# EAGLE design DarlekDistro (EAGLE 6.5.0)
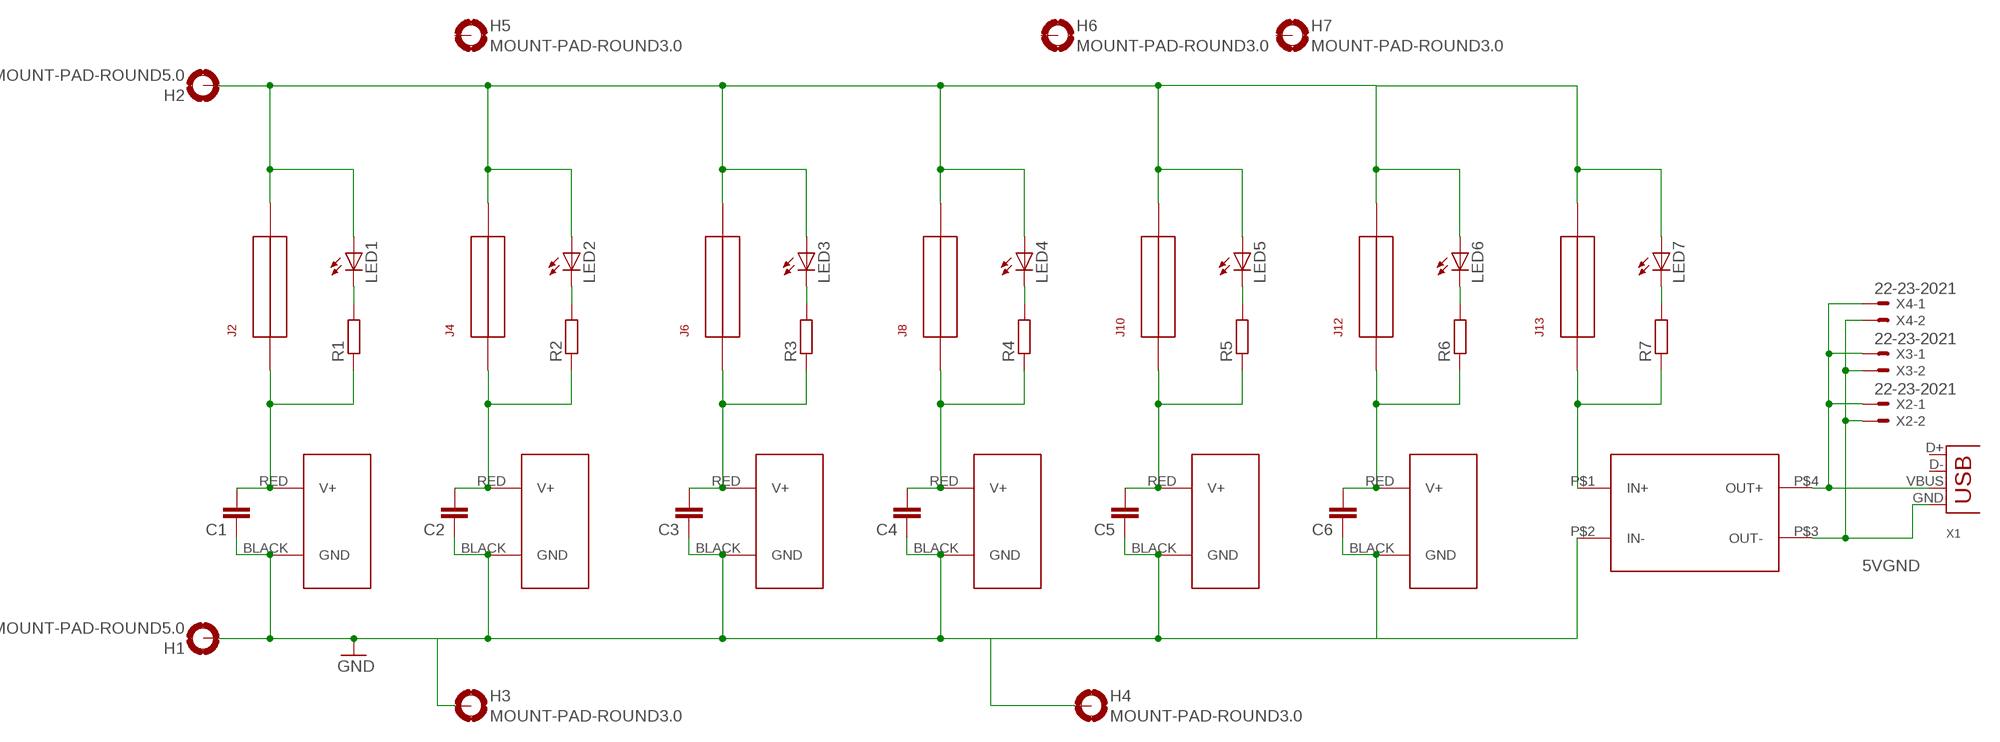
[diagram p0: schematic, sheet 1]

## Parts
C1  C-EU050-025X075  [C050-025X075]
C2  C-EU050-025X075  [C050-025X075]
C3  C-EU050-025X075  [C050-025X075]
C4  C-EU050-025X075  [C050-025X075]
C5  C-EU050-025X075  [C050-025X075]
C6  C-EU050-025X075  [C050-025X075]
H1  MOUNT-PAD-ROUND5.0  [5,0-PAD]
H2  MOUNT-PAD-ROUND5.0  [5,0-PAD]
H3  MOUNT-PAD-ROUND3.0  [3,0-PAD]
H4  MOUNT-PAD-ROUND3.0  [3,0-PAD]
H5  MOUNT-PAD-ROUND3.0  [3,0-PAD]
H6  MOUNT-PAD-ROUND3.0  [3,0-PAD]
H7  MOUNT-PAD-ROUND3.0  [3,0-PAD]
J1  POWERPOLE_POWER10AWG  [POWERPOLE_PAIR_10AWG]
J2  FUSEATC  [FUSE_ATC]
J3  POWERPOLE_POWER10AWG  [POWERPOLE_PAIR_10AWG]
J4  FUSEATC  [FUSE_ATC]
J5  POWERPOLE_POWER10AWG  [POWERPOLE_PAIR_10AWG]
J6  FUSEATC  [FUSE_ATC]
J7  POWERPOLE_POWER10AWG  [POWERPOLE_PAIR_10AWG]
J8  FUSEATC  [FUSE_ATC]
J9  POWERPOLE_POWER10AWG  [POWERPOLE_PAIR_10AWG]
J10  FUSEATC  [FUSE_ATC]
J11  POWERPOLE_POWER10AWG  [POWERPOLE_PAIR_10AWG]
J12  FUSEATC  [FUSE_ATC]
J13  FUSEATC  [FUSE_ATC]
LED1  LED3MM  [LED3MM]
LED2  LED3MM  [LED3MM]
LED3  LED3MM  [LED3MM]
LED4  LED3MM  [LED3MM]
LED5  LED3MM  [LED3MM]
LED6  LED3MM  [LED3MM]
LED7  LED3MM  [LED3MM]
R1  R-EU_0204/7  [0204/7]
R2  R-EU_0204/7  [0204/7]
R3  R-EU_0204/7  [0204/7]
R4  R-EU_0204/7  [0204/7]
R5  R-EU_0204/7  [0204/7]
R6  R-EU_0204/7  [0204/7]
R7  R-EU_0204/7  [0204/7]
U$1  DSN2596_REG  [DSN2596_REG]
X1  USB-A-H  [USB-A-H]
X2  22-23-2021  [22-23-2021]
X3  22-23-2021  [22-23-2021]
X4  22-23-2021  [22-23-2021]

## Nets
5VGND: U$1.P$3(OUT-) X1.GND X2.2 X3.2 X4.2
GND: C1.1 C2.1 C3.1 C4.1 C5.1 C6.1 H1.B5(MOUNT) H3.B3,0(MOUNT) H4.B3,0(MOUNT) J1.BLACK(GND) J3.BLACK(GND) J5.BLACK(GND) J7.BLACK(GND) J9.BLACK(GND) J11.BLACK(GND) U$1.P$2(IN-)
N$1: LED2.K(C) R2.2
N$2: LED1.K(C) R1.2
N$3: LED3.K(C) R3.2
N$4: LED4.K(C) R4.2
N$5: LED5.K(C) R5.2
N$6: LED6.K(C) R6.2
N$7: LED7.K(C) R7.2
N$8: U$1.P$4(OUT+) X1.VBUS X2.1 X3.1 X4.1
PPV1: C1.2 J1.RED(V+) J2.P$1 J2.P$2 R1.1
PPV2: C2.2 J3.RED(V+) J4.P$1 J4.P$2 R2.1
PPV3: C3.2 J5.RED(V+) J6.P$1 J6.P$2 R3.1
PPV4: C4.2 J7.RED(V+) J8.P$1 J8.P$2 R4.1
PPV5: C5.2 J9.RED(V+) J10.P$1 J10.P$2 R5.1
PPV6: C6.2 J11.RED(V+) J12.P$1 J12.P$2 R6.1
PPV7: J13.P$1 J13.P$2 R7.1 U$1.P$1(IN+)
VCC: H2.B5(MOUNT) J2.P$3 J2.P$4 J4.P$3 J4.P$4 J6.P$3 J6.P$4 J8.P$3 J8.P$4 J10.P$3 J10.P$4 J12.P$3 J12.P$4 J13.P$3 J13.P$4 LED1.A LED2.A LED3.A LED4.A LED5.A LED6.A LED7.A
Unconnected: H5.B3,0(MOUNT) H6.B3,0(MOUNT) H7.B3,0(MOUNT) X1.D+ X1.D-

## Library data of the parts
C1-C6 = resistor:C-EU: CAPACITOR, European symbol
H1-H7 = holes:MOUNT-PAD-ROUND: MOUNTING PAD, round
J1 J3 J5 J7 J9 J11 = powerpoles:POWERPOLE_POWER: Anderson Powerpole Power Connector using ameteur radio standard layout
J2 J4 J6 J8 J10 J12 J13 = powerpoles:FUSE
LED1-LED7 = adafruit:LED: LED OSRAM: - CHIPLED LG R971, LG N971, LY N971, LG Q971, LY Q971, LO R971, LY R971 LH N974, LH R974 LS Q976, LO Q976, LY Q976 LO Q996 - Hyper CHIPLED LW Q18S LB Q993, LB Q99A, LB R99A - SideLED LS A670, LO A670, LY A670, LG A670, LP A670 LB A673, LV A673, LT A673, LW A673 LH A674 LY A675 LS A676, LA A676, LO A676, LY A676, LW A676 LS A679, LY A679, LG A679 - Hyper Micro SIDELED® LS Y876, LA Y876, LO Y876, LY Y876 LT Y87S - SmartLED LW L88C, LW L88S LB L89C, LB L89S, LG L890 LS L89K, LO L89K, LY L89K LS L896, LA L896, LO L896, LY L896 - TOPLED LS T670, LO T670, LY T670, LG T670, LP T670 LSG T670, LSP T670, LSY T670, LOP T670, LYG T670 LG T671, LOG T671, LSG T671 LB T673, LV T673, LT T673, LW T673 LH T674 LS T676, LA T676, LO T676, LY T676, LB T676, LH T676, LSB T676, LW T676 LB T67C, LV T67C, LT T67C, LS T67K, LO T67K, LY T67K, LW E67C LS E67B, LA E67B, LO E67B, LY E67B, LB E67C, LV E67C, LT E67C LW T67C LS T679, LY T679, LG T679 LS T770, LO T770, LY T770, LG T770, LP T770 LB T773, LV T773, LT T773, LW T773 LH T774 LS E675, LA E675, LY E675, LS T675 LS T776, LA T776, LO T776, LY T776, LB T776 LHGB T686 LT T68C, LB T68C - Hyper Mini TOPLED® LB M676 - Mini TOPLED Santana® LG M470 LS M47K, LO M47K, LY M47K Source: http://www.osram.convergy.de/
R1-R7 = rcl:R-EU_: RESISTOR, European symbol
U$1 = DarlekParts:DSN2596_REG: DSN2596 regulator breakout board
X1 = con-usb-3:USB: USB Connectors
X2-X4 = con-molex:22-23-2021: .100" (2.54mm) Center Header - 2 Pin; MF: MOLEX; MPN: 22-23-2021; OC_FARNELL: 1462926; OC_NEWARK: 25C3832

## Board
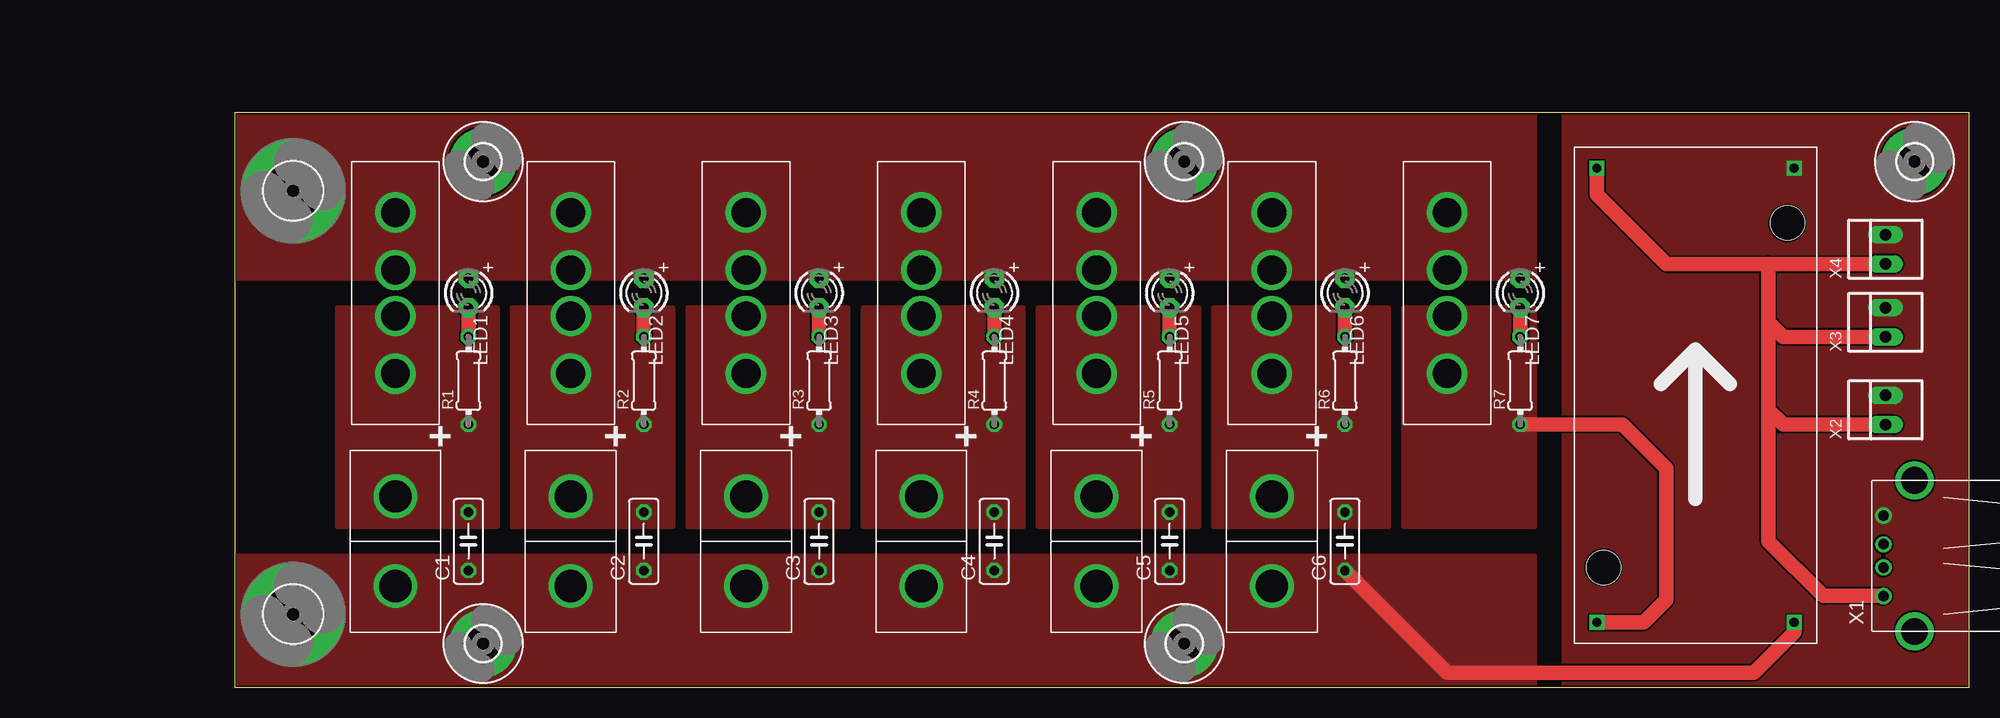
[diagram p1: board, top side]
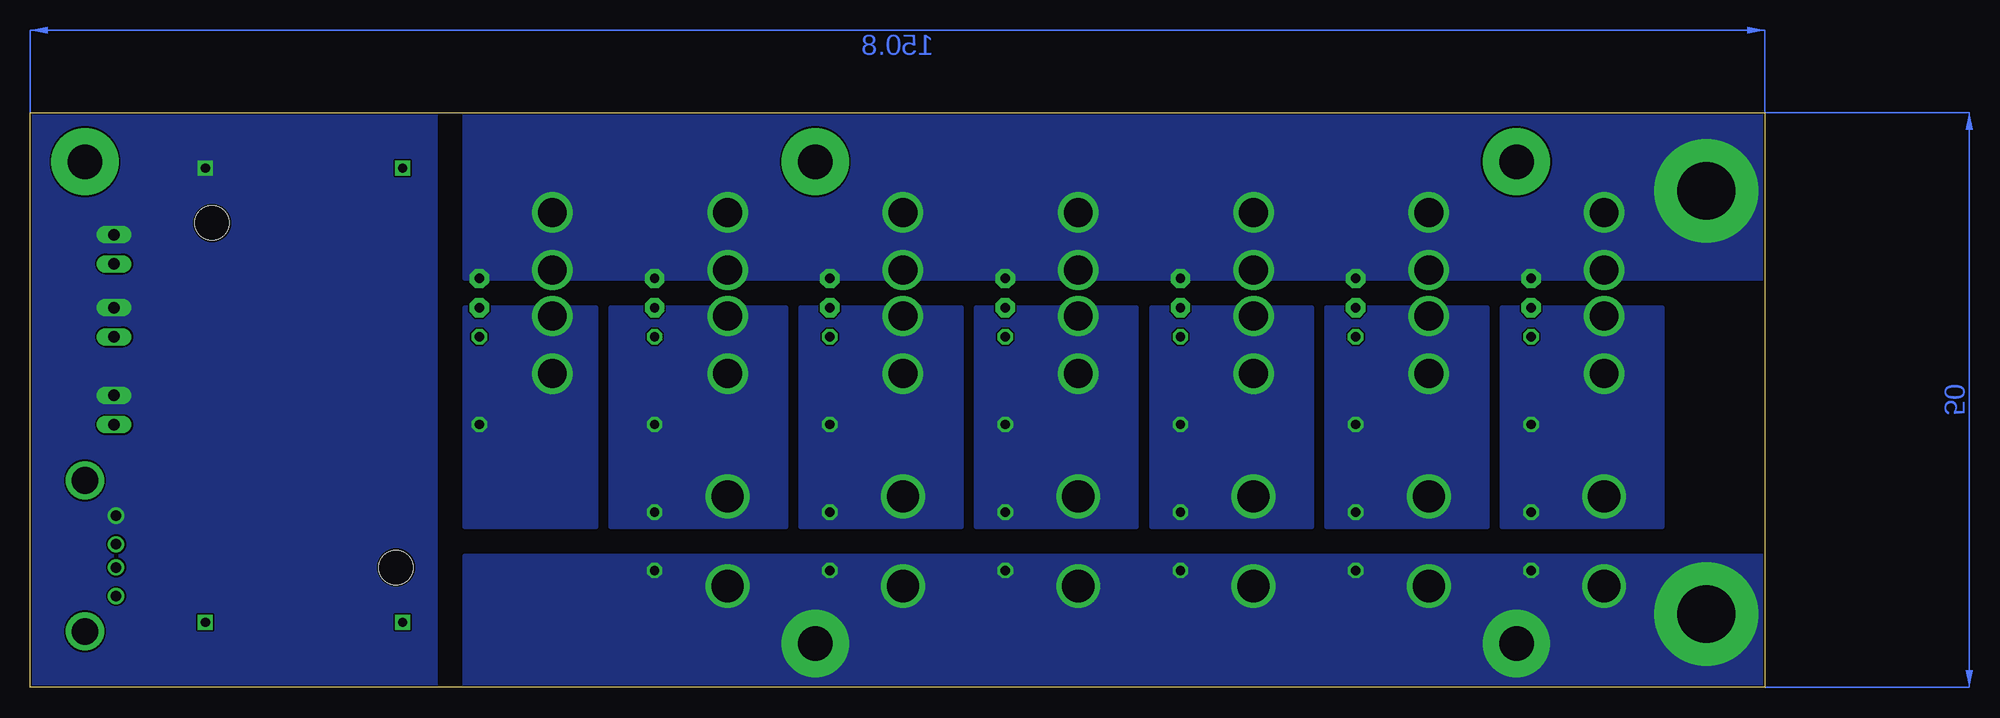
[diagram p2: board, bottom side, seen from below]

Size 150.8 x 50 mm. Coordinates in mm from the lower left corner, seen from the top.
Outline: 0,0 150.8,0 150.8,50 0,50 0,0
Copper layers (1*16): Top 0.035mm / dielectric 1.5mm / Bottom 0.035mm
Design rules "hackvana": minimum track width 6mil, minimum drill 0.3mm, track to track 6mil, track to pad 6mil, pad to pad 6mil, via to via 6mil, smd to smd 0mil, copper to edge 6mil, drill to drill 6mil, minimum pad ring 10mil, minimum via ring 6mil, stop-mask expansion 2mil, vias tented up to drill 100mil, thermal gap 10mil

### Footprints (pad centres in the part's own frame; a part is rotated, then mirrored left to right if it is on the bottom)
C050-025X075 = drill 0.813 octagon: 1 -2.54,0; 2 2.54,0
5,0-PAD = drill 5 pad 9: B5 0,0
3,0-PAD = drill 3 pad 5.842: B3,0 0,0
POWERPOLE_PAIR_10AWG = drill 2.8: BLACK 3.9,0; RED -3.9,0
FUSE_ATC = drill 2.5: P$1 -2,0; P$2 -7,0; P$3 2,0; P$4 7,0
LED3MM = drill 0.813 pad 1.676 octagon: A -1.27,0; K 1.27,0
0204/7 = drill 0.813 octagon: 1 -3.81,0; 2 3.81,0
DSN2596_REG = drill 0.8 square: P$1 -19.748,8.572; P$2 -19.748,-8.572; P$3 19.748,-8.572; P$4 19.748,8.572 | hole 3: -14.986,8.001; 14.986,-8.001
USB-A-H = drill 0.914: D+ 2.718,-1.003; D- 2.718,1.003; GND 2.718,-3.493; VBUS 2.718,3.493 | drill 2.311: P$5 0,-6.566; P$6 0,6.566
22-23-2021 = drill 1 long: 1 -1.27,0; 2 1.27,0

### Placement (x,y rotation side)
C1  20.32,12.7 90 top
C2  35.56,12.7 90 top
C3  50.8,12.7 90 top
C4  66.04,12.7 90 top
C5  81.28,12.7 90 top
C6  96.52,12.7 90 top
H1  5.08,6.35 0 top
H2  5.08,43.18 0 top
H3  21.59,3.81 0 top
H4  82.55,3.81 0 top
H5  82.55,45.72 0 top
H6  21.59,45.72 0 top
H7  146.05,45.72 0 top
J1  13.97,12.7 270 top
J2  13.97,34.29 90 top
J3  29.21,12.7 270 top
J4  29.21,34.29 90 top
J5  44.45,12.7 270 top
J6  44.45,34.29 90 top
J7  59.69,12.7 270 top
J8  59.69,34.29 90 top
J9  74.93,12.7 270 top
J10  74.93,34.29 90 top
J11  90.17,12.7 270 top
J12  90.17,34.29 90 top
J13  105.41,34.29 90 top
LED1  20.32,34.29 270 top
LED2  35.56,34.29 270 top
LED3  50.8,34.29 270 top
LED4  66.04,34.29 270 top
LED5  81.28,34.29 270 top
LED6  96.52,34.29 270 top
LED7  111.76,34.29 270 top
R1  20.32,26.67 90 top
R2  35.56,26.67 90 top
R3  50.8,26.67 90 top
R4  66.04,26.67 90 top
R5  81.28,26.67 90 top
R6  96.52,26.67 90 top
R7  111.76,26.67 90 top
U$1  127,25.4 90 top
X1  146.05,11.43 180 top
X2  143.51,24.13 90 top
X3  143.51,31.75 90 top
X4  143.51,38.1 90 top

### Tracks (layer width: path | path; a pad name or v marks a point on that pad's centre or on a via)
5VGND
  pour Bottom (no thermals): 115.57,52.07 153.67,52.07 153.67,-1.27 115.57,-1.27
  pour Top (no thermals): 115.57,52.07 153.67,52.07 153.67,-1.27 115.57,-1.27
GND
  Top 1.27: U$1.P$2 135.57,4.76 132.08,1.27 105.41,1.27 C6.1
  pour Bottom (no thermals): -5.08,11.43 113.03,11.43 113.03,-1.27 -5.08,-1.27
  pour Top (no thermals): -5.08,11.43 113.03,11.43 113.03,-2.54 -5.08,-2.54
N$1
  Top 1.27: LED2.K R2.2
N$2
  Top 1.27: LED1.K R1.2
N$3
  Top 1.27: R3.2 LED3.K
N$4
  Top 1.27: LED4.K R4.2
N$5
  Top 1.27: R5.2 LED5.K
N$6
  Top 1.27: R6.2 LED6.K
N$7
  Top 1.27: LED7.K R7.2
N$8
  Top 1.27: U$1.P$4 118.43,42.86 124.46,36.83 133.35,36.83 | 133.35,36.83 X4.1 | X3.1 134.62,30.48 133.35,31.75 | 133.35,31.75 133.35,36.83 | X2.1 134.62,22.86 133.35,24.13 | 133.35,24.13 133.35,31.75 | X1.VBUS 138.11,7.94 133.35,12.7 133.35,24.13
PPV1
  pour Bottom (no thermals): 8.89,33.02 22.86,33.02 22.86,13.97 8.89,13.97
  pour Top (no thermals): 8.89,33.02 22.86,33.02 22.86,13.97 8.89,13.97
PPV2
  pour Bottom (no thermals): 24.13,33.02 38.1,33.02 38.1,13.97 24.13,13.97
  pour Top (no thermals): 24.13,33.02 38.1,33.02 38.1,13.97 24.13,13.97
PPV3
  pour Bottom (no thermals): 39.37,33.02 53.34,33.02 53.34,13.97 39.37,13.97
  pour Top (no thermals): 39.37,33.02 53.34,33.02 53.34,13.97 39.37,13.97
PPV4
  pour Bottom (no thermals): 54.61,33.02 68.58,33.02 68.58,13.97 54.61,13.97
  pour Top (no thermals): 54.61,33.02 68.58,33.02 68.58,13.97 54.61,13.97
PPV5
  pour Bottom (no thermals): 69.85,33.02 83.82,33.02 83.82,13.97 69.85,13.97
  pour Top (no thermals): 69.85,33.02 83.82,33.02 83.82,13.97 69.85,13.97
PPV6
  pour Bottom (no thermals): 85.09,33.02 100.33,33.02 100.33,13.97 85.09,13.97
  pour Top (no thermals): 85.09,33.02 100.33,33.02 100.33,13.97 85.09,13.97
PPV7
  Top 1.27: U$1.P$1 122.49,5.65 124.46,7.62 124.46,19.05 120.65,22.86 R7.1
  pour Bottom (no thermals): 101.6,33.02 113.03,33.02 113.03,13.97 101.6,13.97
  pour Top (no thermals): 101.6,33.02 113.03,33.02 113.03,13.97 101.6,13.97
VCC
  pour Bottom (no thermals): -7.62,50.8 113.03,50.8 113.03,35.56 -7.62,35.56
  pour Top (no thermals): -7.62,52.07 113.03,52.07 113.03,35.56 -7.62,35.56
(copper drawn outside any net)
  shapes: Bottom area x2